# EasyEDA Pro project ProPrj_（课设）太阳能板最大功率点追踪主控板 Solar MPPT Tracking controlling board_2024-09-24.epro, schematic Schematic2
Create Date: 2024-02-10; Page Name: Buck for STM32; Project Name: ELEC 3300--MPPT; Schematic Name: Schematic2; Update Date: 2024-02-23; Company: 嘉立创EDA; Page Size: A4; Version: V1.0
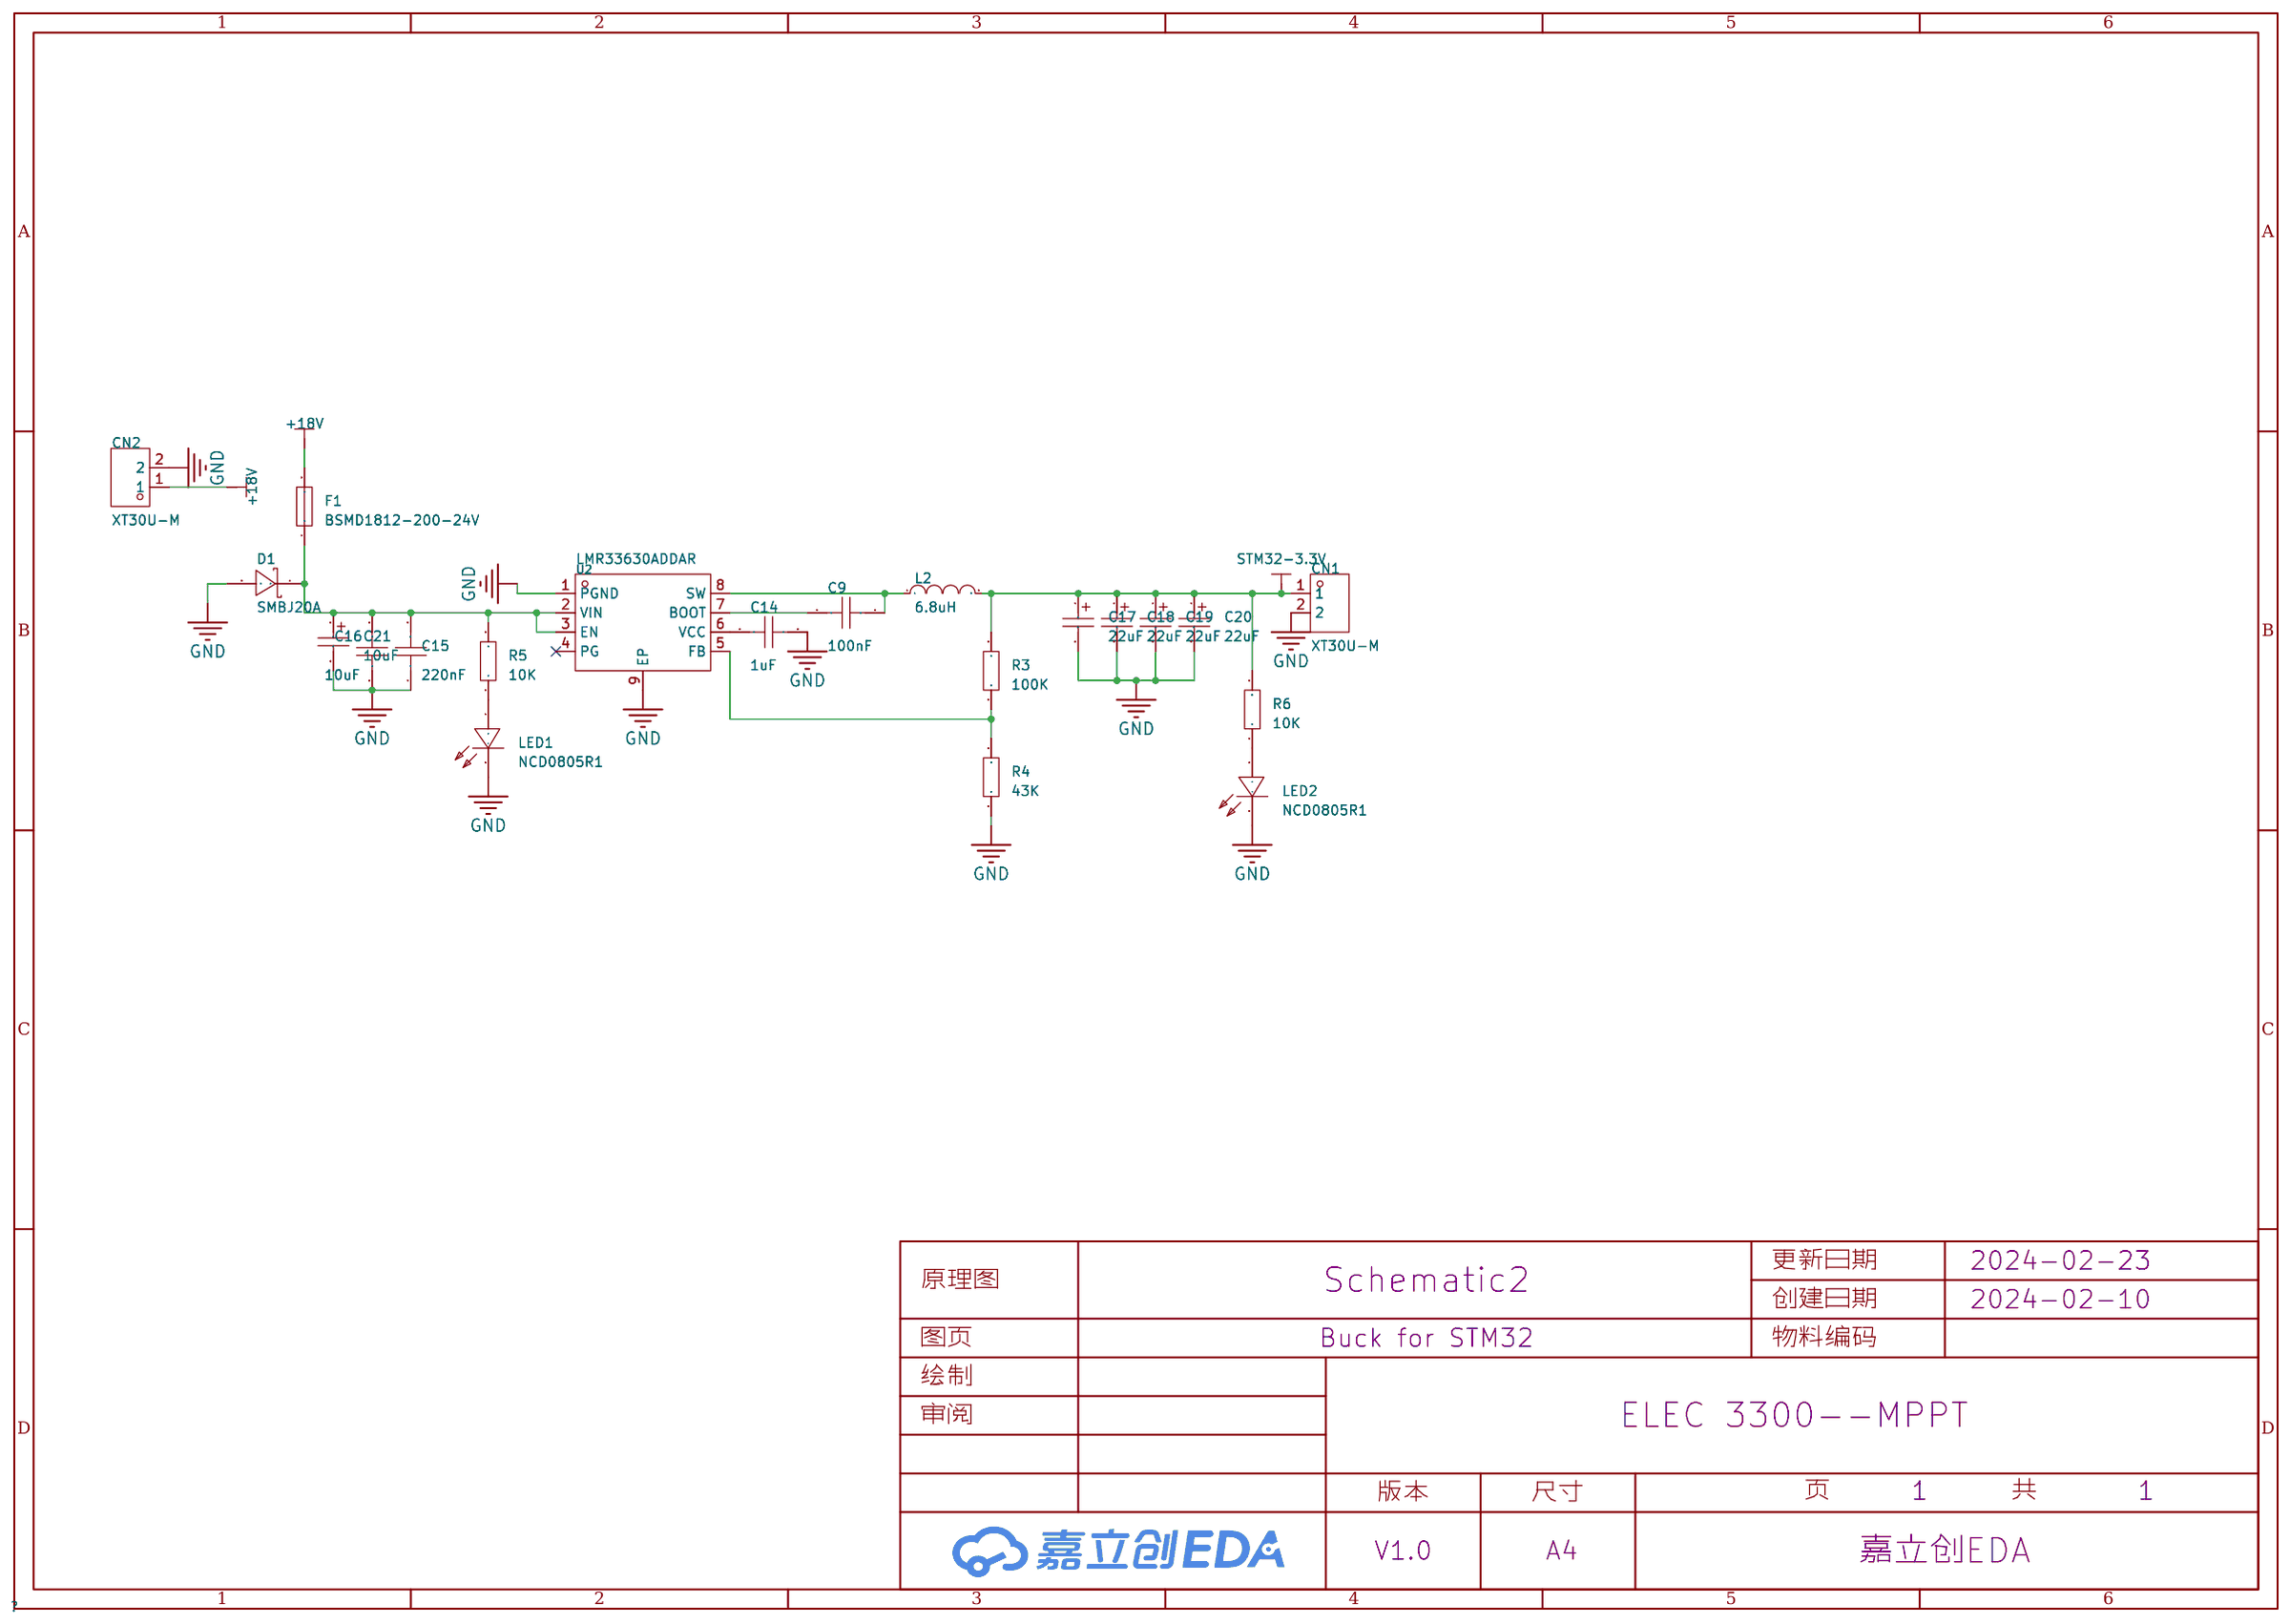
[diagram p0: schematic sheet]

## Parts
C9  100nF  [C0603]
C14  1uF  [C0603]
C15  220nF  [C0603]
C16  10uF  [C0805]
C17  22uF  [CASE-B_3528]
C18  22uF  [CASE-B_3528]
C19  22uF  [CASE-B_3528]
C20  22uF  [CASE-B_3528]
C21  10uF  [CAP-SMD_L3.5-W2.8-R-RD]
CN1  XT30U-M  [CONN-TH_XT30U-M]
CN2  XT30U-M  [CONN-TH_XT30U-M]
D1  SMBJ20A  [SMB_L4.5-W3.7-LS5.4-RD]
F1  BSMD1812-200-24V  [F1812]
L2  6.8uH  [IND-SMD_L5.4-W5.2_FXL0530]
LED1  NCD0805R1  [LED0805-R-RD]
LED2  NCD0805R1  [LED0805-R-RD]
R3  100K  [R0603]
R4  43K  [R0603]
R5  10K  [R0603]
R6  10K  [R0603]
U2  LMR33630ADDAR  [ESOP-8_L4.9-W3.9-P1.27-LS6.0-TL-EP]

## Library data of the parts
C9 C14 C15 = CAP_0603: Supplier Footprint: 0603
C16 = CL21A106KAYNNNE_C15850: 容值:10uF;精度:±10%;额定电压:25V;材质(温度系数):X5R;; LCSC Part Name: 10uF ±10% 25V; Supplier Part: C15850; Manufacturer: SAMSUNG(三星); Manufacturer Part: CL21A106KAYNNNE; Supplier Footprint: 0805; JLCPCB Part Class: Basic Part; Datasheet: https://atta.szlcsc.com/upload/public/pdf/source/20160218/1457707763339.pdf; Supplier: LCSC; Tolerance: ±10%; Voltage Rated: 25V; Temperature Coefficient: X5R; Check: true
C17-C20 = TAJB226K016RNJ: 容值:22uF;精度:±10%;额定电压:16V;等效串联电阻:2.3Ω@100kHz;; LCSC Part Name: 22uF ±10% 16V; Supplier Part: C8020; Manufacturer: Kyocera AVX; Supplier Footprint: CASE-B-3528; JLCPCB Part Class: 扩展库; Datasheet: https://atta.szlcsc.com/upload/public/pdf/source/20160107/1457707750344.pdf; Supplier: LCSC; Tolerance: ±10%; Rated Voltage: 16V; Equivalent Series Resistance(ESR): 2.3Ω@100kHz; Operating Temperature: -55℃~+125℃; Check: true
C21 = TAJB106K025RNJ: 容值:10uF;精度:±10%;额定电压:25V;等效串联电阻:2.5Ω@100kHz;; LCSC Part Name: 10uF ±10% 25V; Supplier Part: C7194; Manufacturer: Kyocera AVX; Supplier Footprint: CASE-B-3528; JLCPCB Part Class: 扩展库; Datasheet: https://atta.szlcsc.com/upload/public/pdf/source/20160107/1457707750344.pdf; Supplier: LCSC; Tolerance: ±10%; Rated Voltage: 25V; Equivalent Series Resistance(ESR): 2.5Ω@100kHz; Operating Temperature: -55℃~+125℃; Check: true
CN1 CN2 = XT30U-M: 类别:-;类型1:-;; LCSC Part Name: AMASS(艾迈斯)轻量版锂电池插头公头 XT30U-M; Supplier Part: C99101; Manufacturer: AMASS(艾迈斯); JLCPCB Part Class: 扩展库; Datasheet: https://atta.szlcsc.com/upload/public/pdf/source/20170606/1496716542582.pdf; Supplier: LCSC; Brand: 艾迈斯; Type: 插头; Colour: 黄色; InterfaceType: 公头
D1 = SMBJ20A_C151922: 反向截止电压(Vrwm):20V;最大钳位电压:32.4V;峰值脉冲电流(Ipp)@10/1000us:18.6A;击穿电压:22.2V;; Supplier Part: C151922; Manufacturer: BORN(伯恩半导体); Supplier Footprint: SMB; JLCPCB Part Class: 扩展库; Datasheet: https://atta.szlcsc.com/upload/public/pdf/source/20200413/C152089_47B9F2142CBB08C8573970559A15E9B6.pdf; Supplier: LCSC; Reverse Stand-Off Voltage (Vrwm): 20V; Maximum Clamping Voltage: 32.4V; Peak Pulse Current (Ipp)@10/1000us: 18.6A; Breakdown Voltage: 22.2V; Type: TVS
F1 = BSMD1812-200-24V: 最大电压:24V;最大电流:40A;保持电流:2A;跳闸电流:4A;; LCSC Part Name: 24V 2A 1812自恢复; Supplier Part: C883157; Manufacturer: BHFUSE(佰宏); Supplier Footprint: 1812; JLCPCB Part Class: 扩展库; Datasheet: https://atta.szlcsc.com/upload/public/pdf/source/20230512/6ED7FF50F668B3AF958C55F12246A840.pdf; Supplier: LCSC; Operating Voltage (Max): 24V; Current Rating (Max): 40A; Hold Current: 2A; Trip Current: 4A; Power Dissipation: 1W; Resistance - Initial (Ri) (Min): 20mΩ; Resistance - Post Trip (R1) (Max): 100mΩ; Maximum Time to Trip: 2s; Operating Temperature: -40℃~+85℃
L2 = FXL0530-6R8-M: 电感值:6.8uH;精度:±20%;额定电流:3.5A;饱和电流(Isat):4A;类型:一体成型电感;; LCSC Part Name: 6.8uH ±20% 4A; Supplier Part: C177249; Manufacturer: cjiang(长江微电); Supplier Footprint: SMD,5.2x5.4mm; JLCPCB Part Class: 扩展库; Datasheet: https://atta.szlcsc.com/upload/public/pdf/source/20230516/4BF6F9C76E81720F52A39ED5FFFA18B4.pdf; Supplier: LCSC; Tolerance: ±20%; Rated Current: 3.5A; Saturation Current (Isat): 4A; DC Resistance (DCR): 90mΩ; Type: 一体成型电感; Check: true
LED1 LED2 = NCD0805R1: 灯头类型:-;发光颜色:红色;正向电压(VF):1.6V~2.6V;功率:65mW;正向电流:20mA;主波长:615nm~630nm;二极管配置:独立二极管;透镜颜色:无色透明透镜;色温:-;发光强度:67mcd~195mcd;发光角度:130°;载带方式:-;工作温度:-30℃~+85℃;; Supplier Part: C84256; Manufacturer: 国星光电; Supplier Footprint: 0805; JLCPCB Part Class: 基础库; Datasheet: https://atta.szlcsc.com/upload/public/pdf/source/20200820/C84256_F0A75A43B3EAD75808600A0514C76B99.pdf; Supplier: LCSC; Emitted Color: 红色; Forward Voltage (VF): 1.6V~2.6V; Power Dissipation: 65mW; Forward Current: 20mA; Dominant Wavelength: 615nm~630nm; Diode Configuration: 独立二极管; Lens Color: 无色透明透镜; Luminous Intensity: 67mcd~195mcd; Viewing Angle: 130°; Operating Temperature: -30℃~+85℃
R3-R6 = Res_0603: Supplier Footprint: 0603
U2 = LMR33630ADDAR: 功能类型:降压型;输出类型:可调;输入电压:3.8V~36V;输出电压:1V~24V;输出电流(最大值):3A;; Supplier Part: C841384; Manufacturer: TI(德州仪器); Supplier Footprint: ESOP-8; JLCPCB Part Class: 扩展库; Datasheet: https://www.ti.com/cn/lit/gpn/lmr33630; Supplier: LCSC; Function: 降压型; Output Type: 可调; Input Voltage: 3.8V~36V; Output Voltage: 1V~24V; Output Current (Max): 3A; Switching Frequency: 400kHz; Operating Temperature: -40℃~+125℃@(TJ); Synchronous Rectification: 是; Number of Outputs: 1; Topology: 降压式; Switch tube (built-in/external): 内置; Check: true

## Nets
+18V: CN2.1 F1.2
GND: C14.2 C15.1 C16.1 C17.2 C18.2 C19.2 C20.2 C21.2 CN1.2 CN2.2 D1.2(A) LED1.2(-) LED2.2(-) R4.1 U2.1(PGND) U2.9(EP)
STM32-3.3V: C17.1 C18.1 C19.1 C20.1 CN1.1 L2.2 R3.2 R6.2
$2N517: C9.1 U2.7(BOOT)
$2N518: C9.2 L2.1 U2.8(SW)
$2N519: C14.1 U2.6(VCC)
$2N524: R3.1 R4.2 U2.5(FB)
$2N4053: C15.2 C16.2 C21.1 D1.1(K) F1.1 R5.2 U2.2(VIN) U2.3(EN)
Net-(LED1-1): LED1.1(+) R5.1
Net-(LED2-1): LED2.1(+) R6.1

Not connected (* = marked no-connect by the designer): U2 4(PG)*
